# EAGLE design Samsung128Oled (EAGLE 5.08)
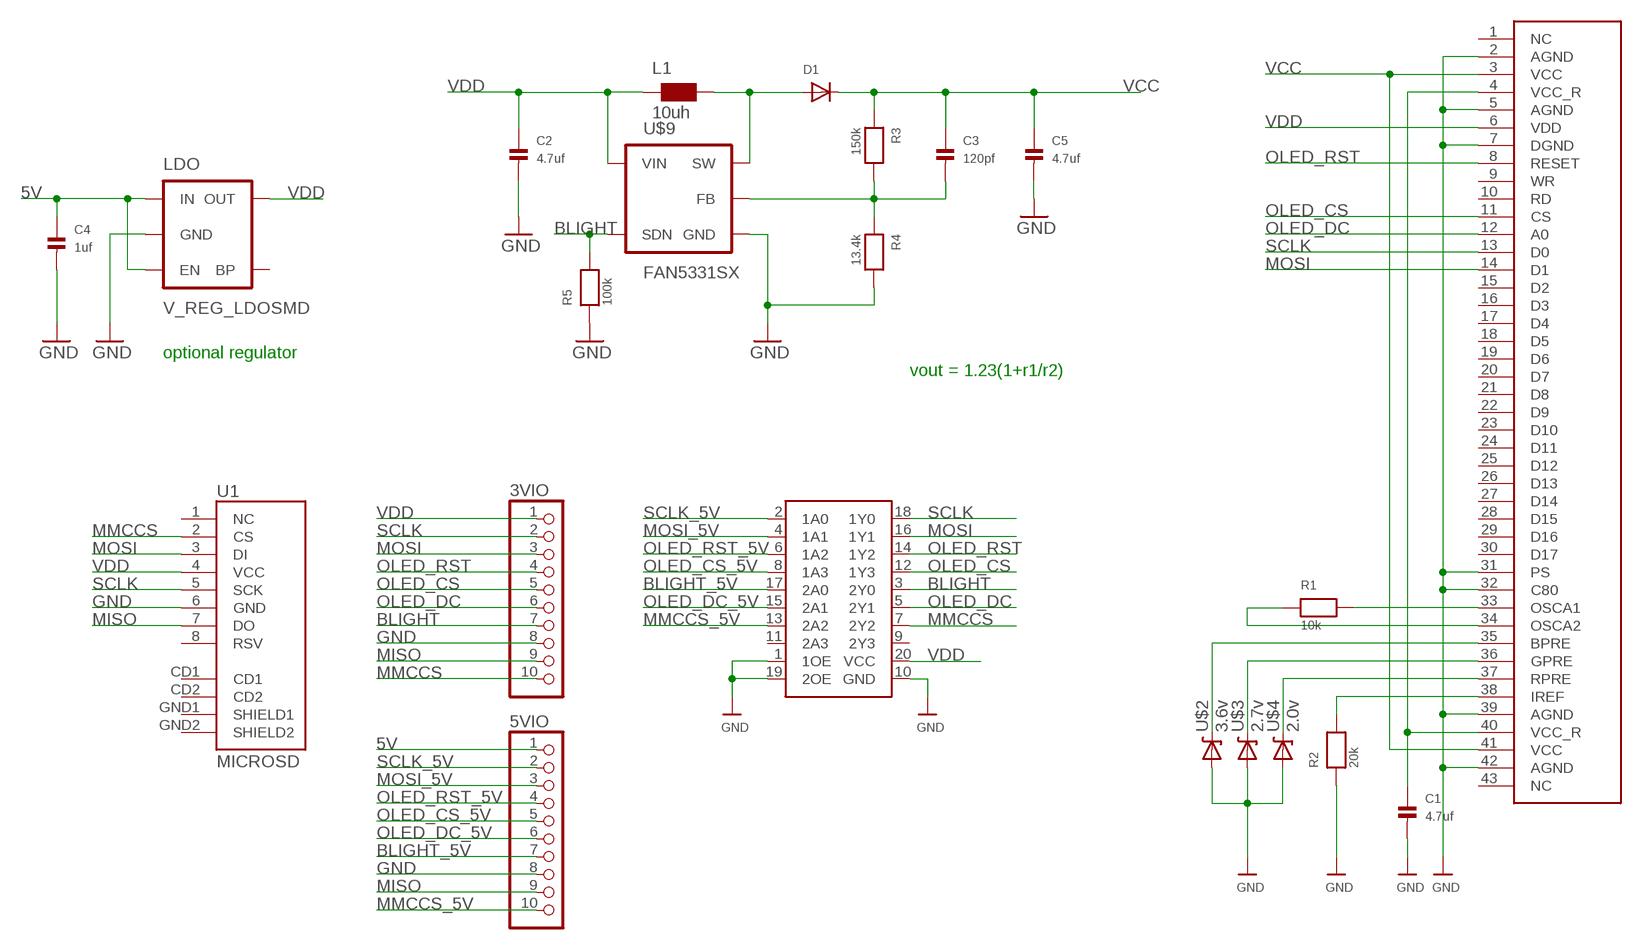
[diagram p0: schematic, sheet 1]

## Parts
3VIO  HEADER-1X10ROUND  [1X10_ROUND]
5VIO  HEADER-1X10ROUND  [1X10_ROUND]
C1  4.7uf  CAP_CERAMIC0805  [0805]
C2  4.7uf  CAP_CERAMIC0805  [0805]
C3  120pf  CAP_CERAMIC0805  [0805]
C4  1uf  CAP_CERAMIC0805  [0805]
C5  4.7uf  CAP_CERAMIC0805  [0805]
D1  DIODESOD-123  [SOD-123]
L1  10uh  WE-KIHQ_1008  [WE-KI_1008_B]
LDO  V_REG_LDOSMD  [SOT23-5]
R1  10k  RESISTOR0805  [0805]
R2  20k  RESISTOR0805  [0805]
R3  150k  RESISTOR0805  [0805]
R4  13.4k  RESISTOR0805  [0805]
R5  100k  RESISTOR0805  [0805]
U1  MICROSD  USD-SOCKETNEW  [MICRO-SD-SOCKET-PP]
U$1  SAMSUNGOLED128  [43X07MM]
U$2  3.6v  DIODE-ZENER-BZT52  [SOD-323]
U$3  2.7v  DIODE-ZENER-BZT52  [SOD-323]
U$4  2.0v  DIODE-ZENER-BZT52  [SOD-323]
U$9  FAN5331SX  [SOT23-5]
U$11  74LVC244  [TSSOP20]

## Nets
5V: 5VIO.1 C4.1 LDO.1(IN) LDO.3(EN)
BLIGHT: 3VIO.7 R5.2 U$9.5(SDN) U$11.3(2Y0)
BLIGHT_5V: 5VIO.7 U$11.17(2A0)
GND: 3VIO.8 5VIO.8 C1.2 C2.2 C4.2 C5.2 LDO.2(GND) R2.1 R4.2 R5.1 U1.6(GND) U$1.2(AGND) U$1.5(AGND) U$1.7(DGND) U$1.31(PS) U$1.32(C80) U$1.39(AGND) U$1.42(AGND) U$2.2(A) U$3.2(A) U$4.2(A) U$9.2(GND) U$11.1(1OE) U$11.10(GND) U$11.19(2OE)
MISO: 3VIO.9 5VIO.9 U1.7(DO)
MMCCS: 3VIO.10 U1.2(CS) U$11.7(2Y2)
MMCCS_5V: 5VIO.10 U$11.13(2A2)
MOSI: 3VIO.3 U1.3(DI) U$1.14(D1) U$11.16(1Y1)
MOSI_5V: 5VIO.3 U$11.4(1A1)
N$1: D1.A L1.1 U$9.1(SW)
N$3: C1.1 U$1.4(VCC_R) U$1.40(VCC_R)
N$5: C3.2 R3.2 R4.1 U$9.3(FB)
N$12: R1.2 U$1.33(OSCA1)
N$13: R1.1 U$1.34(OSCA2)
N$14: U$1.35(BPRE) U$2.1(C)
N$15: U$1.36(GPRE) U$3.1(C)
N$16: U$1.37(RPRE) U$4.1(C)
N$17: R2.2 U$1.38(IREF)
OLED_CS: 3VIO.5 U$1.11(CS) U$11.12(1Y3)
OLED_CS_5V: 5VIO.5 U$11.8(1A3)
OLED_DC: 3VIO.6 U$1.12(A0) U$11.5(2Y1)
OLED_DC_5V: 5VIO.6 U$11.15(2A1)
OLED_RST: 3VIO.4 U$1.8(RESET) U$11.14(1Y2)
OLED_RST_5V: 5VIO.4 U$11.6(1A2)
SCLK: 3VIO.2 U1.5(SCK) U$1.13(D0) U$11.18(1Y0)
SCLK_5V: 5VIO.2 U$11.2(1A0)
VCC [power]: C3.1 C5.1 D1.C R3.1 U$1.3(VCC) U$1.41(VCC)
VDD: 3VIO.1 C2.1 L1.2 LDO.5(OUT) U1.4(VCC) U$1.6(VDD) U$9.4(VIN) U$11.20(VCC)
Unconnected: LDO.4(BP) U1.1(NC) U1.8(RSV) U1.CD1 U1.CD2 U1.GND1(SHIELD1) U1.GND2(SHIELD2) U$1.1(NC) U$1.9(WR) U$1.10(RD) U$1.15(D2) U$1.16(D3) U$1.17(D4) U$1.18(D5) U$1.19(D6) U$1.20(D7) U$1.21(D8) U$1.22(D9) U$1.23(D10) U$1.24(D11) U$1.25(D12) U$1.26(D13) U$1.27(D14) U$1.28(D15) U$1.29(D16) U$1.30(D17) U$1.43(NC) U$11.9(2Y3) U$11.11(2A3)

## Notes on the sheet
- optional regulator
- vout = 1.23(1+r1/r2)

## Library data of the parts
3VIO 5VIO = microbuilder:HEADER-1X10: PIN HEADER
C1-C5 = PeterAtMega644:CAP_CERAMIC: Ceramic Capacitors 0603 - 0603 Surface Mount Capacitors 3pF 250V +/-0.1pF RF Ceramic Capacitor[Digikey: 712-1347-1-ND] 16 pF 50V 5% Ceramic Capacitor[Digikey: 445-5051-2-ND] 18 pF 250V 5% RF Ceramic Capcitor [Digikey: 478-3505-1-ND] 22 pF 50V Ceramic Capacitor [Digikey: PCC220ACVTR-ND] 33 pF 50V 5% Ceramic Capacitor 56 pF 250V 5% C0G RF Ceramic Capcitor [Digikey: 490-4867-1-ND] 680 pF 50V Ceramic Capacitor 2200 pF 50V 5% C0G Ceramic Capacitor [Digikey: 445-1297-1-ND] 5600 pF 100V 5% X7R Ceramic Capacitor [Digikey: 478-3711-1-ND] 0.1 µF 25V 10% Ceramic Capacitor [Digikey: PCC2277TR-ND] 0.22 µF 16V 10% X7R Ceramic Capacitor [Digikey: 445-1318-1-ND] 1.0 µF 25V 10% Ceramic Capacitor [Digikey: 445-5146-2-ND] 0805 - 0805 Surface Mount Capacitors 220 pF 250V 2% RF Ceramic Capacitor [Digikey: 712-1398-1-ND] 1000 pF 50V 2% NP0 Ceramic Capacitor [Digikey: 478-3760-1-ND] 0.1 µF 25V 10% Ceramic Capacitor [Digikey: PCC1828TR-ND] 1.0 µF 16V 10% Ceramic Capacitor[Digikey: 490-1691-2-ND] 10.0 µF 10V 10% Ceramic Capacitor[Digikey: 709-1228-1-ND] 1206 - 1206 Surface Mount Capacitors
D1 = microbuilder:DIODE: Diode SMADIODE - SMA Surface Mount Package 20V 1A Schottky Diode Digikey: 641-1014-6-ND SOD-123 30V 500mA (430mV Vf) Schottky Diode - Digikey: B0530W-FDICT-ND SOD-323 10V 570mA (380mV Vf, 3ns) Schottky Diode - Digikey: ZLLS410CT-ND SOD-523 30V 30mA Schottky Diode (RB751S-40TE61) - Digikey: RB751S-40TE61CT-ND SOT23-R/W - SOT23 Package (R = Solder Paste/Reflow Ovens, W = Hand-Soldering) BAT54Film 40V 300mA - Digikey: 497-7162-1-ND DO-1N4148 Through Hole Small Current Diode (any model)
L1 = PeterAtMega644:WE-KIHQ: SMD Wire Wound Ceramic Inductor WE-KIHQ - High current - Highest Quality factor in size 0805 - up to 98 - High thermal stability - High SRF -- Bluetooth -- Wireless LAN -- RF oscillation circuit -- IF impedance matching -- IG choke
LDO = PeterAtMega644:V_REG_LDO: Voltage Regulator LDO Standard 150mA LDO voltage regulator in SOT-23 layout. Micrel part MIC5205. BP (by-pass) pin is used to lower output noise with 470pF cap.
R1-R5 = PeterAtMega644:RESISTOR: Resistors 0603 - 0603 Surface Mount Package 0 Ohm 1/10 Watt 1% Resistor 15 Ohm 1/10 Watt 1% Resistor 33 Ohm 1/10 Watt 1% Resistor 49.9 Ohm 1/10 Watt 1% Resistor 100 Ohm 1/10 Watt 1% Resistor 150 Ohm 1/10 Watt 1% Resistor 240 Ohm 1/10 Watt 1% Resistor 390 Ohm 1/10 Watt 1% Resistor 560 Ohm 1/10 Watt 1% Resistor 750 Ohm 1/10 Watt 1% Resistor 1.0K Ohm 1/10 Watt 1% Resistor 1.5K Ohm 1/10 Watt 1% Resistor 2.0K Ohm 1/10 Watt 1% Resistor 10.0K Ohm 1/10 Watt 1% Resistor 20.0K Ohm 1/10 Watt 1% Resistor 33.0K Ohm 1/10 Watt 1% Resistor 100.0K Ohm 1/10 Watt 1% Resistor 0805 - 0805 Surface Mount Package 0 Ohm 1/8 Watt 1% Resistor 33 Ohm 1/8 Watt 1% Resistor 100 Ohm 1/8 Watt 1% Resistor 150 Ohm 1/8 Watt 1% Resistor 200 Ohm 1/8 Watt 1% Resistor 240 Ohm 1/8 Watt 1% Resistor 330 Ohm 1/8 Watt 1% Resistor 390 Ohm 1/8 Watt 1% Resistor 470 Ohm 1/8 Watt 1% Resistor 1.0K Ohm 1/8 Watt 1% Resistor 1.5K Ohm 1/8 Watt 1% Resistor 2.0K Ohm 1/8 Watt 1% Resistor 4.7K Ohm 1/8 Watt 1% Resistor 5.1K Ohm 1/8 Watt 1% Resistor 5.6K Ohm 1/8 Watt 1% Resistor 10.0K Ohm 1/8 Watt 1% Resistor 22.0K Ohm 1/8 Watt 1% Resistor 33.0K Ohm 1/8 Watt 1% Resistor 100K Ohm 1/8 Watt 1% Resistor 1206 - 1206 Surface Mount Package
U1 = SparkFun:USD-SOCKET: microSD Socket Push-push type uSD socket. Schematic element and footprint production proven. Spark Fun Electronics SKU : PRT-00127. tDoc lines correctly indicate media card edge positions when inserting (unlocked, locked, depressed).
U$1 = PeterAtMega644:SAMSUNGOLED128
U$2-U$4 = SparkFun:DIODE-ZENER: Zener Diode Production Part - 8199 3.4V Zener Voltage
U$9 = PeterAtMega644:FAN5331SX: OLED Supply with 20V Integrated Switch
U$11 = PeterAtMega644:74LVC244

## Net classes
0 default: width 0.203 mm, drill 0.33 mm, clearance 0.178 mm
1 power: width 0.203 mm, drill 0.33 mm, clearance 0.178 mm

## Board
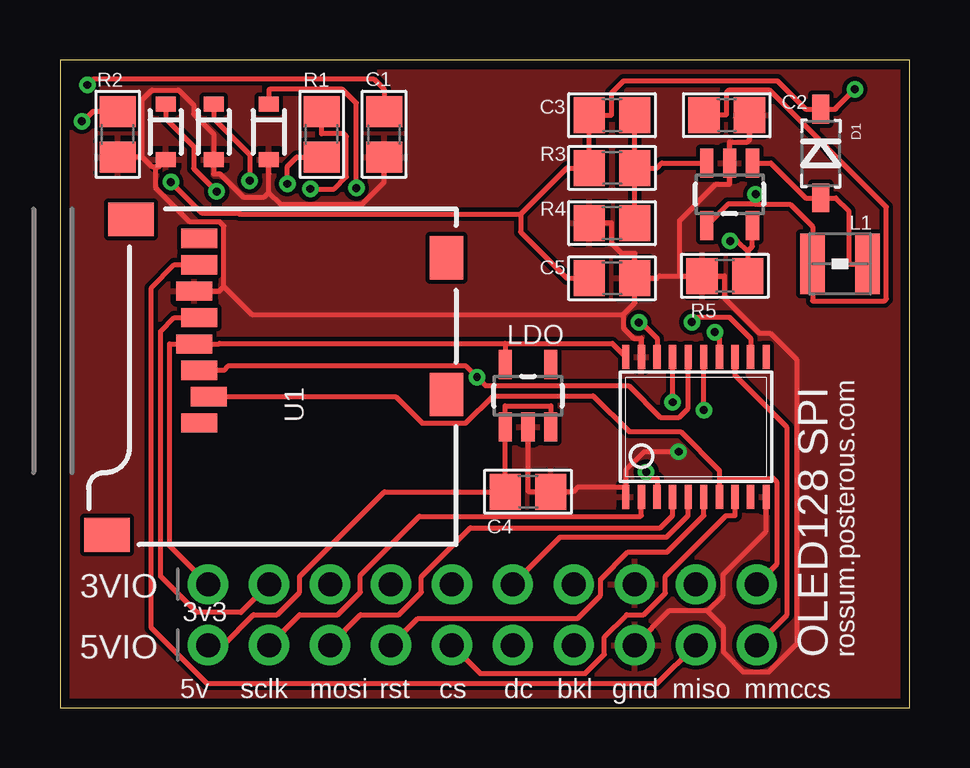
[diagram p1: board, top side]
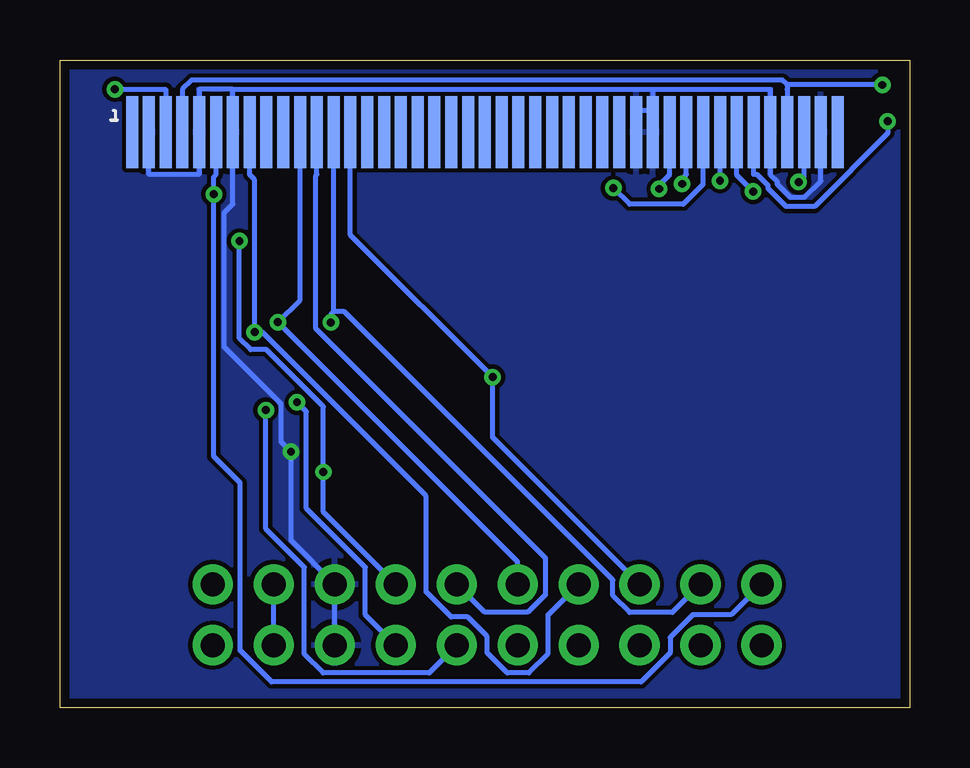
[diagram p2: board, bottom side, seen from below]

Size 35.4 x 27 mm. Coordinates in mm from the lower left corner, seen from the top.
Outline: 0,0 35.4,0 35.4,27 0,27 0,0
Copper layers (1*16): Top 0.0356mm / dielectric 1.5011mm / Bottom 0.0356mm
Design rules "LaenPCBOrder *": minimum track width 6mil, minimum drill 13mil, track to track 6mil, track to pad 6mil, pad to pad 6mil, via to via 6mil, smd to smd 6mil, copper to edge 15mil, drill to drill 6mil, minimum pad ring 7mil, minimum via ring 7mil, stop-mask expansion 4mil, vias tented up to drill 20mil, thermal gap 10mil

### Footprints (pad centres in the part's own frame; a part is rotated, then mirrored left to right if it is on the bottom)
1X10_ROUND = drill 1 pad 1.676 round: 1 -11.43,0; 2 -8.89,0; 3 -6.35,0; 4 -3.81,0; 5 -1.27,0; 6 1.27,0; 7 3.81,0; 8 6.35,0; 9 8.89,0; 10 11.43,0
0805 = smd 1.3 x 1.5: 1 -0.95,0; 2 0.95,0
SOD-123 = smd 1.2 x 0.7: A 1.85,0; C -1.85,0
WE-KI_1008_B = smd 1.02 x 2.54: 1 -1.145,0; 2 1.145,0
SOT23-5 = smd 0.55 x 1.2: 1 -0.95,-1.3; 2 0,-1.3; 3 0.95,-1.3; 4 0.95,1.3; 5 -0.95,1.3
MICRO-SD-SOCKET-PP = smd 0.8 x 1.5: 1 -8.94,10.7; 2 -7.84,10.3; 3 -6.74,10.7; 4 -5.64,10.9; 5 -4.54,10.7; 6 -3.44,10.9; 7 -2.34,10.7; 8 -1.24,10.7 | smd 1.4 x 1.9: CD1 -0.45,13.55; GND1 -13.6,14.55 | smd 1.8 x 1.4: CD2 -2.05,0.4; GND2 -7.75,0.4
43X07MM = smd 0.5 x 3: 1 -14.7,0; 2 -14,0; 3 -13.3,0; 4 -12.6,0; 5 -11.9,0; 6 -11.2,0; 7 -10.5,0; 8 -9.8,0; 9 -9.1,0; 10 -8.4,0; 11 -7.7,0; 12 -7,0; 13 -6.3,0; 14 -5.6,0; 15 -4.9,0; 16 -4.2,0; 17 -3.5,0; 18 -2.8,0; 19 -2.1,0; 20 -1.4,0; 21 -0.7,0; 22 0,0; 23 0.7,0; 24 1.4,0; 25 2.1,0; 26 2.8,0; 27 3.5,0; 28 4.2,0; 29 4.9,0; 30 5.6,0; 31 6.3,0; 32 7,0; 33 7.7,0; 34 8.4,0; 35 9.1,0; 36 9.8,0; 37 10.5,0; 38 11.2,0; 39 11.9,0; 40 12.6,0; 41 13.3,0; 42 14,0; 43 14.7,0
SOD-323 = smd 0.63 x 0.83: 1 -1.15,0; 2 1.15,0
TSSOP20 = smd 0.305 x 0.991: 1 -2.925,-2.918; 2 -2.275,-2.918; 3 -1.625,-2.918; 4 -0.975,-2.918; 5 -0.325,-2.918; 6 0.325,-2.918; 7 0.975,-2.918; 8 1.625,-2.918; 9 2.275,-2.918; 10 2.925,-2.918; 11 2.925,2.918; 12 2.275,2.918; 13 1.625,2.918; 14 0.975,2.918; 15 0.325,2.918; 16 -0.325,2.918; 17 -0.975,2.918; 18 -1.625,2.918; 19 -2.275,2.918; 20 -2.925,2.918

### Placement (x,y rotation side)
3VIO  17.6,5.14 0 top
5VIO  17.6,2.6 0 top
C1  13.5,23.9 270 top
C2  27.78,24.7 0 top
C3  23,24.7 0 top
C4  19.5,9 0 top
C5  23,17.9 0 top
D1  31.7,23.1 270 top
L1  32.5,18.5 180 top
LDO  19.5,13 0 top
R1  10.9,23.9 90 top
R2  2.4,23.9 90 top
R3  23,22.5 0 top
R4  23,20.2 180 top
R5  27.7,18 0 top
U1  16.5,20.8 90 top
U$1  17.7,24 0 bottom
U$2  8.7,24 270 top
U$3  6.4,24 270 top
U$4  4.4,24 270 top
U$9  27.9,21.4 180 top
U$11  26.5,11.7 0 top

### Tracks (layer width: path | path; a pad name or v marks a point on that pad's centre or on a via)
5V
  Top 0.203: LDO.3 20.45,12.58 18.55,12.58 LDO.1 C4.1 13.51,9 9.98,5.47 9.98,4.81 9.04,3.87 8.06,3.87 6.79,2.6 5VIO.1
BLIGHT  (via drill 0.33 pad 0.69)
  Top 0.203: v24.43,9.82 24.69,9.56 24.88,9.56 U$11.3 | v27.92,19.45 28.23,19.45 28.65,19.03 | 28.65,19.03 R5.2 | U$9.5 28.85,19.22 28.66,19.03 28.65,19.03
  Bottom 0.203: 3VIO.7 24.43,8.15 v24.43,9.82 24.43,12.54 26.8,14.93 27.45,14.93 27.92,15.39 v27.92,19.45
BLIGHT_5V  (via drill 0.33 pad 0.69)
  Top 0.203: v25.52,12.73 U$11.17
  Bottom 0.203: v25.52,12.73 25.13,12.34 25.13,8.3 22.68,5.85 22.68,3.87 5VIO.7
GND  (via drill 0.33 pad 0.69)
  Top 0.203: 8.7,21.48 9.19,20.98 12.58,20.98 13.5,21.9 13.5,22.02 C1.2 | 3.43,22.95 3.43,25.34 3.83,25.75 4.94,25.75 5.56,25.12 5.56,24.75 6.4,23.91 U$3.2 6.4,22.55 6.4,22.26 6.66,22.26 7.63,21.28 8.51,21.28 8.7,21.48 | 4,22.53 3.85,22.53 3.43,22.95 | U$4.2 4.08,22.53 4,22.53 | 4,22.53 4,21.66 5.41,20.24 6.67,20.24 6.83,20.08 6.83,17.56 | 8.7,21.48 8.7,22.26 U$2.2 | 23.47,16.39 23.95,16.87 C5.2 | 23.47,16.39 23.47,15.82 23.9,15.39 24.23,15.39 U$11.19 | 23.47,16.39 8,16.39 6.83,17.56 | 6.83,17.56 6.63,17.36 U1.6 | R4.2 22.98,20.2 22.98,19.35 23.4,18.93 23.95,18.93 C5.2 | v25.77,10.67 24.34,10.67 23.57,9.9 23.57,9.56 23.57,9.17 | 26.96,4.02 27.65,3.34 27.65,2.31 28.49,1.48 29.52,1.48 30.69,2.65 30.69,14.51 29.59,15.61 29.14,15.61 27.68,17.07 27.68,18 R5.1 25.82,18 | 25.82,18 24.98,18 24.88,17.9 C5.2 | 25.82,18 25.82,20.31 27.33,21.82 27.9,21.82 U$9.2 27.9,23.58 28.64,23.58 28.73,23.67 C2.2 | 26.96,4.02 27.62,4.68 27.62,5.55 29.43,7.35 U$11.10 | 5VIO.8 25.37,4.02 26.96,4.02 | 3.43,22.95 R2.1 | LDO.2 19.5,9.02 19.52,9 C4.2 21.38,9 21.55,9.17 23.57,9.17 | 23.57,9.17 U$11.1
  Bottom 0.203: U$1.42 3.7,21.95 4.38,21.27 4.96,21.27 5.52,21.83 5.52,21.94 5.8,22.22 U$1.39 5.8,25.78 10.7,25.78 | 28.2,25.78 10.7,25.78 | 10.7,25.78 10.7,25.68 10.7,24.89 | 28.2,25.78 U$1.7 28.2,20.98 28.56,20.63 28.56,15.03 26.19,12.66 26.19,11.08 v25.77,10.67 25.77,6.96 3VIO.8 5VIO.8 | 28.2,25.78 29.6,25.78 U$1.5 29.6,22.22 31.7,22.22 U$1.2 | U$1.31 11.4,24.89 10.7,24.89 | 10.7,24.89 U$1.32
  pour Top: 0,0 35.5,0 35.5,27 0,27
  pour Bottom: 0,0 35.5,0 35.5,27 0,27
MISO
  Top 0.203: U1.7 4.77,18.46 3.8,17.49 3.8,3.31 6.11,1 24.89,1 5VIO.9
  Bottom 0.203: 5VIO.9 3VIO.9
MMCCS
  Top 0.203: U1.2 13.99,12.96 15.09,11.86 16.9,11.86 18.05,13 22.21,13 23.71,11.5 25.86,11.5 27.48,9.88 27.48,9.56 | 27.48,9.56 29.72,9.56 29.86,9.42 29.86,5.97 3VIO.10 | 27.48,9.56 27.48,9.46 U$11.7
MMCCS_5V
  Top 0.203: 5VIO.10 30.3,3.87 30.3,11.67 28.12,13.84 U$11.13
MOSI  (via drill 0.33 pad 0.69)
  Top 0.203: U$11.16 26.18,13.84 26.18,12.47 25.8,12.1 25.01,12.1 23.69,13.42 17.73,13.42 v17.37,13.78 16.93,14.23 7,14.23 6.83,14.06 U1.3
  Bottom 0.203: U$1.14 23.3,19.71 v17.37,13.78 17.37,11.26 3VIO.3
MOSI_5V
  Top 0.203: 5VIO.3 12.52,3.87 14.12,3.87 15.06,4.81 15.06,5.46 17.1,7.49 25.01,7.49 25.52,8.01 U$11.4
N$1
  Top 0.203: U$9.1 29.62,22.7 31.07,21.25 D1.A 32.33,21.25 32.85,20.72 32.85,18.5 L1.1
N$3  (via drill 0.33 pad 0.69)
  Top 0.203: v1.14,25.96 1.39,26.21 13.07,26.21 13.5,25.78 C1.1
  Bottom 0.203: v1.14,25.96 5.1,25.96 | 5.1,25.96 5.3,26.16 29.92,26.16 30.3,25.78 U$1.4 | 5.1,25.96 5.1,25.78 U$1.40
N$5
  Top 0.203: 24.41,22.5 23.95,22.96 C3.2 | 24.41,22.5 24.88,22.5 25.08,22.7 U$9.3 | 24.41,22.5 R3.2 R4.1
N$12  (via drill 0.33 pad 0.69)
  Top 0.203: v10.43,21.62 11.43,21.62 11.93,22.13 11.93,23.82 11.83,23.92 10.9,23.92 R1.2
  Bottom 0.203: v10.43,21.62 10.43,21.79 10,22.22 U$1.33
N$13  (via drill 0.33 pad 0.69)
  Top 0.203: v9.48,21.83 9.48,22.55 9.87,22.95 R1.1
  Bottom 0.203: v9.48,21.83 9.48,22.05 9.3,22.22 U$1.34
N$14  (via drill 0.33 pad 0.69)
  Top 0.203: U$2.1 8.7,25.74 8.73,25.78 11.77,25.78 12.35,25.2 v12.35,21.66
  Bottom 0.203: U$1.35 8.6,21.82 9.44,20.98 11.66,20.98 v12.35,21.66
N$15  (via drill 0.33 pad 0.69)
  Top 0.203: v7.9,21.96 7.9,23.06 6.4,24.55 U$3.1 | v7.9,21.96
  Bottom 0.203: v7.9,21.96 7.9,22.22 U$1.36
N$16  (via drill 0.33 pad 0.69)
  Top 0.203: v6.52,21.51 5.56,22.47 5.56,23.39 4.4,24.55 U$4.1
  Bottom 0.203: U$1.37 7.2,22.19 v6.52,21.51
N$17  (via drill 0.33 pad 0.69)
  Top 0.203: R2.2 1.37,24.85 0.96,24.44 v0.91,24.44
  Bottom 0.203: v0.91,24.44 0.91,23.94 3.96,20.89 5.15,20.89 5.9,21.64 5.9,21.77 6.35,22.22 6.5,22.22 U$1.38
OLED_CS  (via drill 0.33 pad 0.69)
  Top 0.203: U$11.12 28.77,15.39 27.89,16.28 26.53,16.28 v26.32,16.07
  Bottom 0.203: 3VIO.5 16.33,6.07 v26.32,16.07 25.4,17 U$1.11
OLED_CS_5V
  Top 0.203: U$11.8 28.12,8.01 27.76,8.01 25.22,5.47 25.22,4.77 24.32,3.87 23.61,3.87 22.68,2.94 22.68,2.21 21.89,1.42 17.51,1.42 5VIO.5
OLED_DC
  Top 0.203: U$11.5 26.18,8.01 25.28,7.11 20.84,7.11 3VIO.6
  Bottom 0.203: 3VIO.6 17.7,3.97 15.91,3.97 15.17,4.72 15.17,6.22 24.74,15.8 24.74,22.18 24.7,22.22 U$1.12
OLED_DC_5V  (via drill 0.33 pad 0.69)
  Top 0.203: v26.82,12.4 U$11.15
  Bottom 0.203: 5VIO.6 20.02,1.45 24.44,1.45 25.22,2.23 25.22,5.85 26.82,7.46 v26.82,12.4
OLED_RST  (via drill 0.33 pad 0.69)
  Top 0.203: U$11.14 27.48,15.47 v27.29,15.65
  Bottom 0.203: 3VIO.4 15.06,3.87 15.06,2.25 15.86,1.45 16.76,1.45 17.6,2.29 17.6,2.96 18.42,3.78 19.1,3.78 20.14,4.82 20.14,8.82 26.97,15.65 v27.29,15.65 27.29,22.01 27.5,22.22 U$1.8
OLED_RST_5V
  Top 0.203: 5VIO.4 14.91,3.72 21.57,3.72 22.53,4.68 22.53,5.35 23.66,6.48 25.3,6.48 26.82,8.01 U$11.6
SCLK  (via drill 0.33 pad 0.69)
  Top 0.203: v24.12,16.05 24.21,16.05 24.88,15.39 U$11.18 | U1.5 4.77,16.26 4.19,15.68 4.19,5.47 5.69,3.96 7.54,3.96 3VIO.2
  Bottom 0.203: 24,16.51 24.12,16.39 v24.12,16.05 | 24,16.51 23.55,16.51 12.37,5.32 12.37,4.67 11.67,3.96 9.88,3.96 3VIO.2 | 24,16.51 24,22.22 U$1.13
SCLK_5V
  Top 0.203: U$11.2 24.23,8.01 24.19,7.97 14.97,7.97 12.52,5.52 12.52,4.81 11.58,3.87 9.98,3.87 5VIO.2
VCC  (via drill 0.33 pad 0.69)
  Top 0.203: v4.62,21.91 5.91,20.62 7.44,20.62 7.49,20.57 19.19,20.57 | 19.19,20.57 19.19,19.83 21.12,17.9 C5.1 | 19.19,20.57 21.12,22.5 R3.1 C3.1 22.98,24.7 22.98,25.63 23.48,26.13 29.89,26.13 31.07,24.95 D1.C 32.33,24.95 32.33,24.99 v33.12,25.78
  Bottom 0.203: U$1.41 4.4,22.13 v4.62,21.91 | v33.12,25.78 31,25.78 U$1.3
VDD  (via drill 0.33 pad 0.69)
  Top 0.203: 28.98,20.98 27.83,20.98 U$9.4 | 28.98,20.98 30.43,20.98 31.36,20.05 L1.2 31.36,16.95 34.35,16.95 34.44,17.04 34.44,20.87 29.57,25.73 27.86,25.73 27.76,25.63 27.76,24.7 C2.1 | v28.98,21.4 28.98,20.98 | U$11.20 23.01,15.18 18.55,15.18 | 18.55,15.18 LDO.5 | 18.55,15.18 6.65,15.18 6.63,15.16 U1.4 5.08,15.16 4.57,15.16 4.57,6.74 3VIO.1
  Bottom 0.203: 3VIO.1 7.44,3.87 9.03,3.87 9.98,2.92 9.98,2.27 11.19,1.07 26.58,1.07 27.89,2.38 27.89,9.37 28.98,10.46 v28.98,21.4 28.98,22.14 28.9,22.22 U$1.6

### Text on the board
tPlace: 3v3 | OLED128 SPI | rossum.posterous.com | 5v | sclk | mosi | rst | cs | dc | bkl | gnd | miso | mmccs